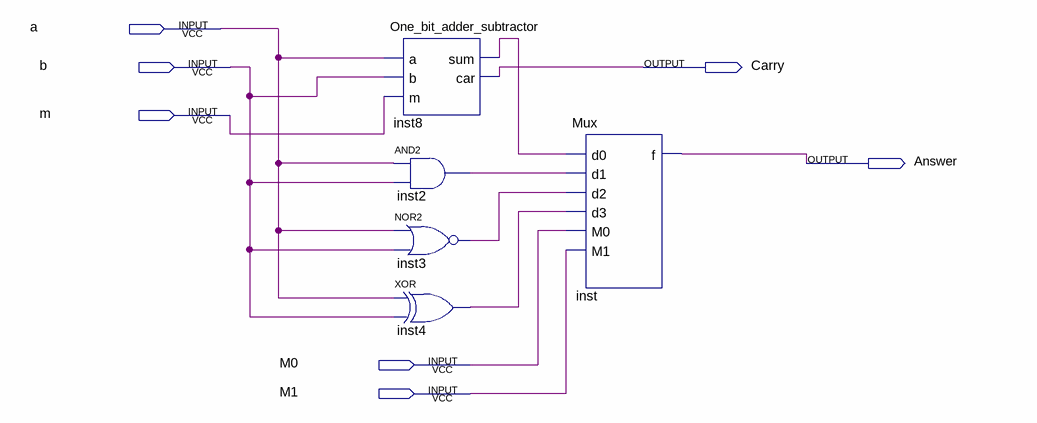
[diagram p0: schematic sheet]
// Quartus schematic OnebitAlu.bdf as structural Verilog: 5 symbols, 7 pins
module OnebitAlu (
  input  a,
  input  b,
  input  m,
  input  M0,
  input  M1,
  output Carry,
  output Answer
);

  wire inst2_out, inst3_out, inst4_out, inst8_sum;

  One_bit_adder_subtractor inst8 (.a(a), .b(b), .m(m), .sum(inst8_sum), .car(Carry));
  and inst2 (inst2_out, a, b);
  nor inst3 (inst3_out, a, b);
  xor inst4 (inst4_out, a, b);
  Mux inst (.d0(inst8_sum), .d1(inst2_out), .d2(inst3_out), .d3(inst4_out), .M0(M0), .M1(M1), .f(Answer));
endmodule
